# Altium schematic sheet Sensors_revB3.SchDoc
size A3; SheetNumber: 2; SheetTotal: 3
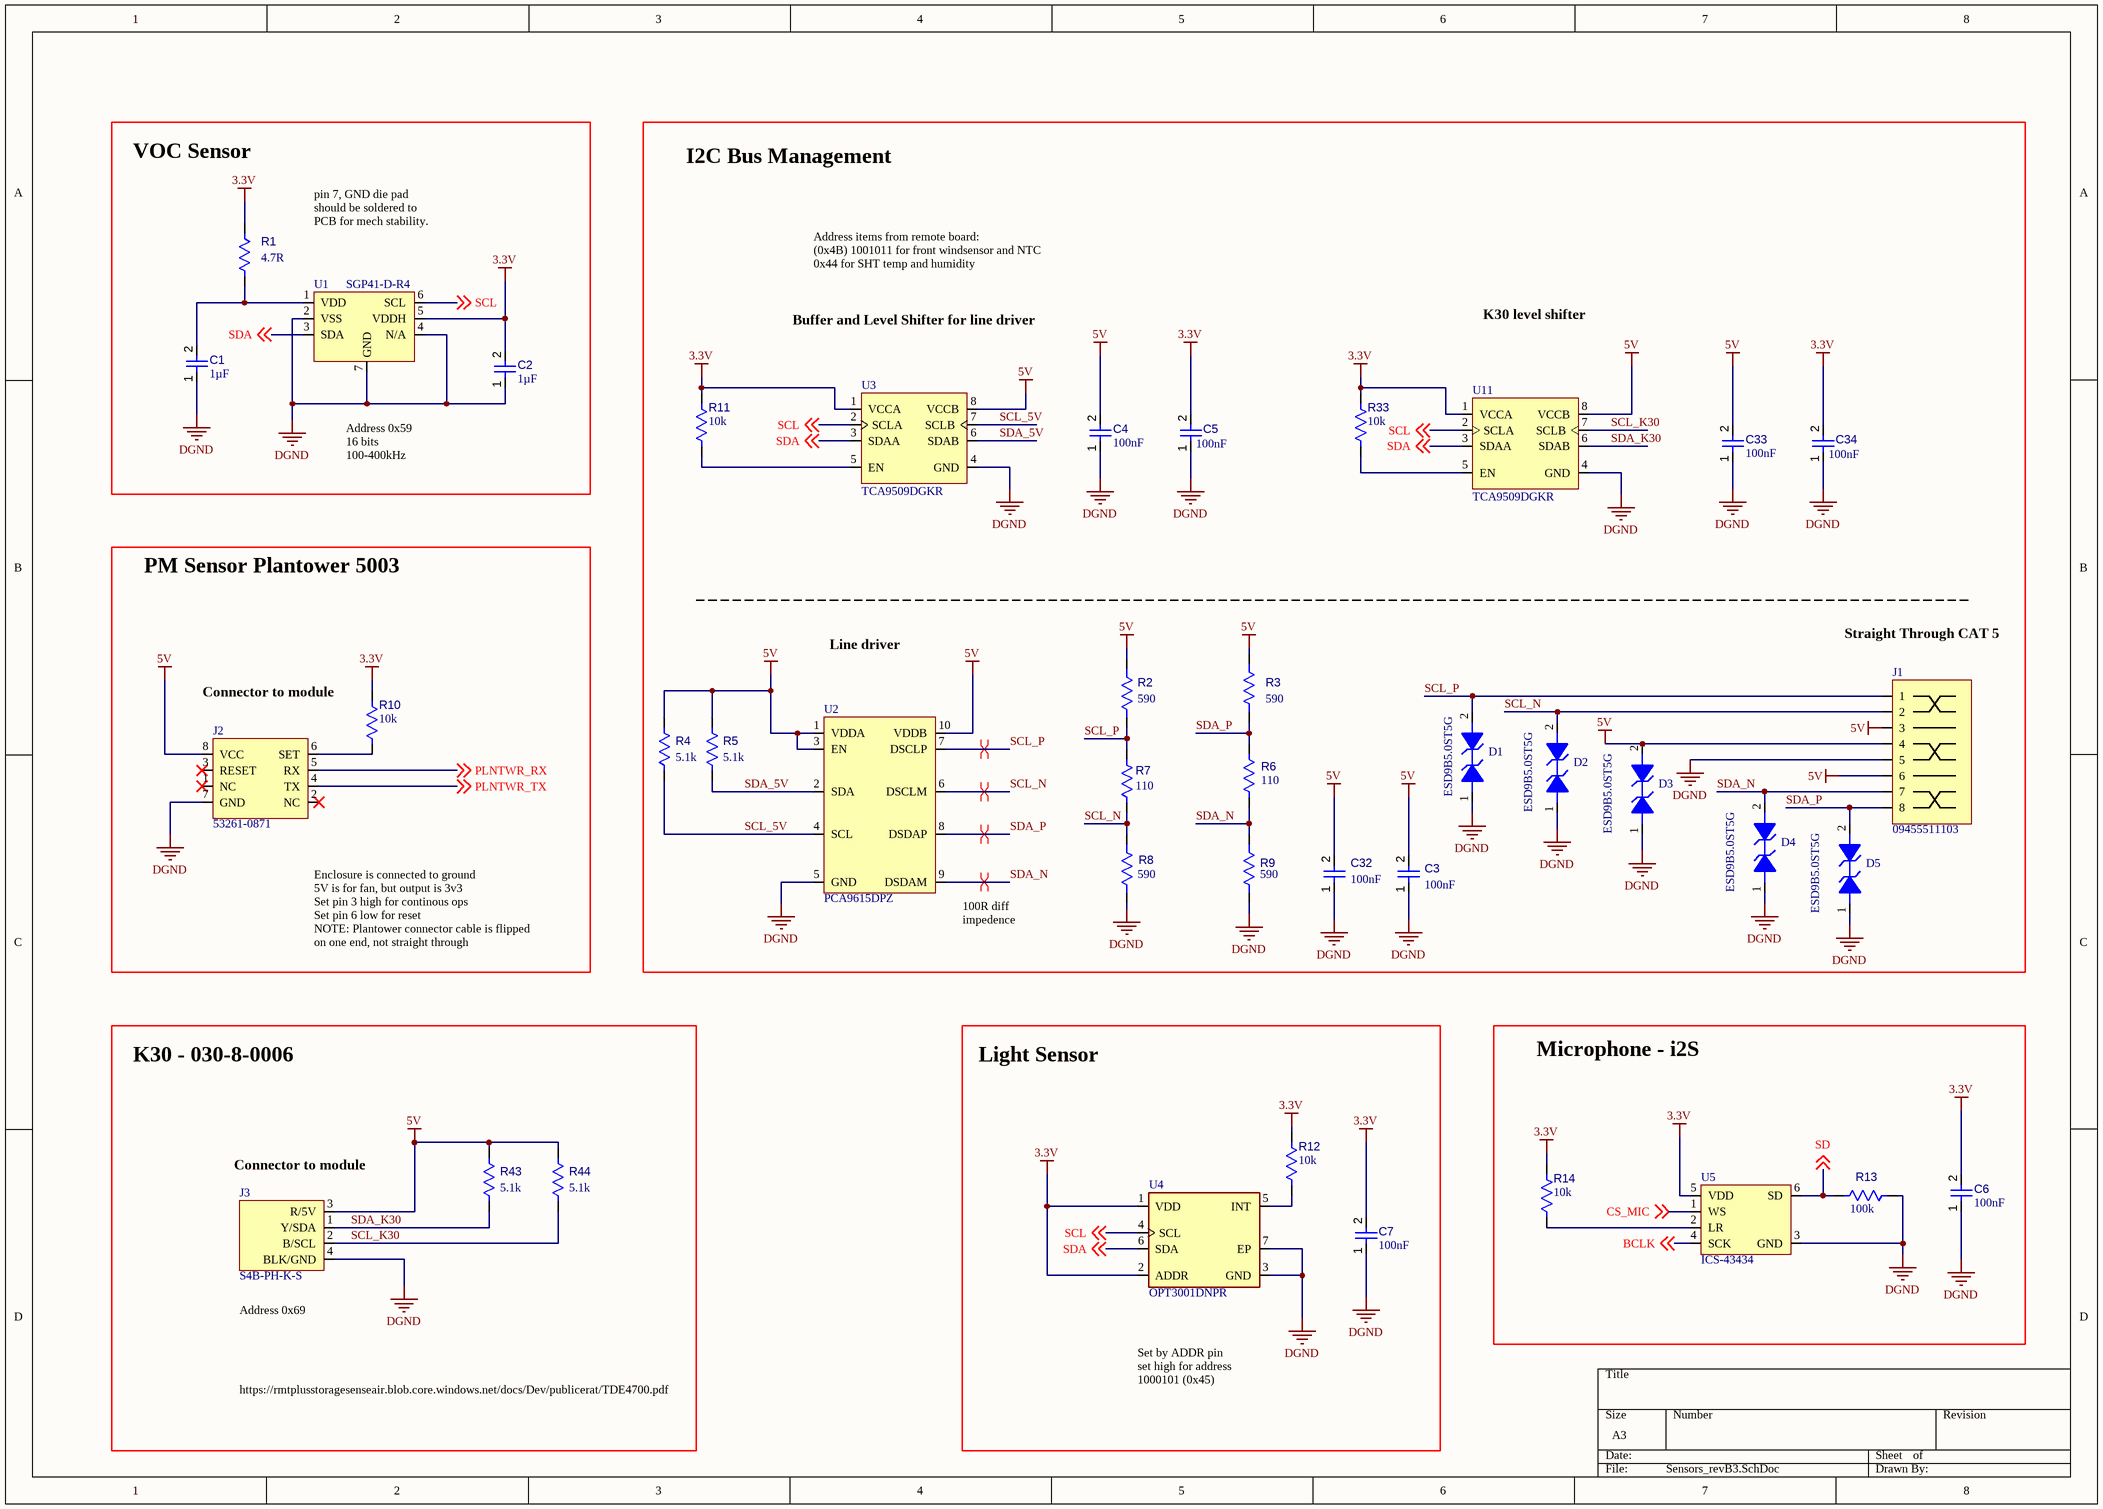
[diagram p0: Sensors_revB3.SchDoc]

## Parts
C1  value 1µF  [MANUF_CAP_0603]  (hidden comment: CL10B105KA8NFNC)
C2  value 1µF  [MANUF_CAP_0603]  (hidden comment: CL10B105KA8NFNC)
C3  value 100nF  [MANUF_CAP_0603]  (hidden comment: CC0603KRX7R7BB104)
C4  value 100nF  [MANUF_CAP_0603]  (hidden comment: CC0603KRX7R7BB104)
C5  value 100nF  [MANUF_CAP_0603]  (hidden comment: CC0603KRX7R7BB104)
C6  value 100nF  [MANUF_CAP_0603]  (hidden comment: CC0603KRX7R7BB104)
C7  value 100nF  [MANUF_CAP_0603]  (hidden comment: CC0603KRX7R7BB104)
C32  value 100nF  [MANUF_CAP_0603]  (hidden comment: CC0603KRX7R7BB104)
C33  value 100nF  [MANUF_CAP_0603]  (hidden comment: CC0603KRX7R7BB104)
C34  value 100nF  [MANUF_CAP_0603]  (hidden comment: CC0603KRX7R7BB104)
D1  ESD9B5.0ST5G  [ONSC-SOD-923-2-514AB-01_V]
D2  ESD9B5.0ST5G  [ONSC-SOD-923-2-514AB-01_V]
D3  ESD9B5.0ST5G  [ONSC-SOD-923-2-514AB-01_V]
D4  ESD9B5.0ST5G  [ONSC-SOD-923-2-514AB-01_V]
D5  ESD9B5.0ST5G  [ONSC-SOD-923-2-514AB-01_V]
J1  09455511103  [09455511103-Footprint-1]
J2  53261-0871  [FP-532610871-MFG]
J3  S4B-PH-K-S  [S4B-PH-K-S-Footprint-1]
R1  value 4.7R  [0805]  (hidden comment: SR0805FR-7W4R7L)
R2  value 590  [MANUF_RES_0603]  (hidden comment: ERJ-3EKF5900V)
R3  value 590  [MANUF_RES_0603]  (hidden comment: ERJ-3EKF5900V)
R4  value 5.1k  [0805]  (hidden comment: RC0805JR-075K1L)
R5  value 5.1k  [0805]  (hidden comment: RC0805JR-075K1L)
R6  value 110  [MANUF_RES_0603]  (hidden comment: RMCF0603FT110R)
R7  value 110  [MANUF_RES_0603]  (hidden comment: RMCF0603FT110R)
R8  value 590  [MANUF_RES_0603]  (hidden comment: ERJ-3EKF5900V)
R9  value 590  [MANUF_RES_0603]  (hidden comment: ERJ-3EKF5900V)
R10  value 10k  [MANUF_RES_0603]  (hidden comment: RC0603FR-0710KL)
R11  value 10k  [MANUF_RES_0603]  (hidden comment: RC0603FR-0710KL)
R12  value 10k  [MANUF_RES_0603]  (hidden comment: RC0603FR-0710KL)
R13  value 100k  [FP-RNCP0805-MFG]  (hidden comment: RCC0805100KFKEA)
R14  value 10k  [MANUF_RES_0603]  (hidden comment: RC0603FR-0710KL)
R33  value 10k  [MANUF_RES_0603]  (hidden comment: RC0603FR-0710KL)
R43  value 5.1k  [0805]  (hidden comment: RC0805JR-075K1L)
R44  value 5.1k  [0805]  (hidden comment: RC0805JR-075K1L)
U1  SGP41-D-R4  [SGP41-D-R4-Footprint-1]
U2  PCA9615DPZ  [TSSOP50P490X110-10N]
U3  TCA9509DGKR  [TSOP65P490X110-8N]
U4  OPT3001DNPR  [FP-DNP0006A-MFG]
U5  ICS-43434  [FP-ICS-43434-MFG]
U11  TCA9509DGKR  [TSOP65P490X110-8N]

## Blocks framed on the sheet
VOC Sensor: C1 C2 R1 U1
I2C Bus Management: C3-C5 C32-C34 D1-D5 J1 R2-R9 R11 R33 U2 U3 U11
PM Sensor Plantower 5003: J2 R10
K30 - 030-8-0006: J3 R43 R44
Light Sensor: C7 R12 U4
Microphone - i2S: C6 R13 R14 U5

## Nets
3.3V: C2.2 C5.2 C6.2 C7.2 C34.2 R1.2 R10.1 R11.1 R12.1 R14.1 R33.1 U1.5(VDDH) U3.1(VCCA) U4.1(VDD) U4.2(ADDR) U5.5(VDD) U11.1(VCCA)
5V: C3.2 C4.2 C32.2 C33.2 D3.2(A2) J1.3 J1.4 J1.6 J2.8(VCC) J3.3(R/5V) R2.2 R3.2 R4.2 R5.2 R43.2 R44.2 U2.1(VDDA) U2.3(EN) U2.10(VDDB) U3.8(VCCB) U11.8(VCCB)
DGND: C1.1 C2.1 C3.1 C4.1 C5.1 C6.1 C7.1 C32.1 C33.1 C34.1 D1.1(A1) D2.1(A1) D3.1(A1) D4.1(A1) D5.1(A1) J1.5 J2.7(GND) J3.4(BLK/GND) R8.1 R9.1 R13.1 U1.2(VSS) U1.4(N/A) U1.7(GND) U2.5(GND) U3.4(GND) U4.3(GND) U4.7(EP) U5.3(GND) U11.4(GND)
BCLK: U5.4(SCK) ; off-sheet BCLK
CS_MIC: U5.1(WS) ; off-sheet CS_MIC
PLNTWR_RX: J2.5(RX) ; off-sheet PLNTWR_RX
PLNTWR_TX: J2.4(TX) ; off-sheet PLNTWR_TX
SCL: U1.6(SCL) U3.2(SCLA) U4.4(SCL) U11.2(SCLA) ; off-sheet SCL
SCL_5V: R4.1 U2.4(SCL) U3.7(SCLB)
SCL_K30: J3.2(B/SCL) R44.1 U11.7(SCLB)
SCL_N: D2.2(A2) J1.2 R7.1 R8.2 U2.6(DSCLM)
SCL_P: D1.2(A2) J1.1 R2.1 R7.2 U2.7(DSCLP)
SD: R13.2 U5.6(SD) ; off-sheet SD
SDA: U1.3(SDA) U3.3(SDAA) U4.6(SDA) U11.3(SDAA) ; off-sheet SDA
SDA_5V: R5.1 U2.2(SDA) U3.6(SDAB)
SDA_K30: J3.1(Y/SDA) R43.1 U11.6(SDAB)
SDA_N: D4.2(A2) J1.7 R6.1 R9.2 U2.9(DSDAM)
SDA_P: D5.2(A2) J1.8 R3.1 R6.2 U2.8(DSDAP)
NetC1_2: C1.2 R1.1 U1.1(VDD)
NetJ2_6: J2.6(SET) R10.2
NetR11_2: R11.2 U3.5(EN)
NetR12_2: R12.2 U4.5(INT)
NetR14_2: R14.2 U5.2(LR)
NetR33_2: R33.2 U11.5(EN)

Not connected (* = marked no-connect by the designer): J2 1(NC)* 2(NC)* 3(RESET)*

## Layout directives
differential pair: SCL_N, SCL_P, SDA_N, SDA_P

## Notes on the sheet
- pin 7, GND die pad should be soldered to PCB for mech stability.
- Address items from remote board:
  (0x4B) 1001011 for front windsensor and NTC
  0x44 for SHT temp and humidity
- Buffer and Level Shifter for line driver
- K30 level shifter
- Address 0x59
  16 bits
  100-400kHz
- Line driver
- (near J1) Straight Through CAT 5
- (near R10) Connector to module
- Enclosure is connected to ground
  5V is for fan, but output is 3v3
  Set pin 3 high for continous ops
  Set pin 6 low for reset
  NOTE: Plantower connector cable is flipped on one end, not straight through
- (near U2) 100R diff impedence
- (near J3) Connector to module
- (near J3) Address 0x69
- Set by ADDR pin
  set high for address 1000101 (0x45)
- https://rmtplusstoragesenseair.blob.core.windows.net/docs/Dev/publicerat/TDE4700.pdf

## Library data of the parts
C1 C2 = CMP-001-00098-2: Ceramic Capacitor, Multilayer, Ceramic, 25V, 10% +Tol, 10% -Tol, X7R, 15% TC, 1uF, Surface Mount, 0603; Pins: 2; Mounting Technology: Surface Mount; Min Operating Temperature: -55°C; Case/Package: 0603; Capacitor Type: Ceramic; RoHS Compliant: Yes; Max Operating Temperature: 125°C
C3-C7 C32-C34 = CMP-001-00099-4: Ceramic Capacitor, Multilayer, Ceramic, 16V, 10% +Tol, 10% -Tol, X7R, 15% TC, 0.1uF, Surface Mount, 0603; Pins: 2; Min Operating Temperature: -55°C; Max Operating Temperature: 125°C; Case/Package: 0603; RoHS Compliant: Yes; Mounting Technology: Surface Mount; Capacitor Type: Ceramic
D1-D5 = CMP-004-00032-1: Trans Voltage Suppressor Diode, 5V V(RWM), Bidirectional, 1 Element, Silicon; Pins: 2; Max Operating Temperature: 150°C; RoHS Compliant: Yes; Min Operating Temperature: -55°C
J1 = CMP-002-00071-6: Telecom and Datacom Connector, 8 Contact(s), Female, Straight, Solder Terminal, Locking, Jack; Mounting Technology: Board; RoHS Compliant: Yes; Max Operating Temperature: 70°C; Min Operating Temperature: -40°C; Connector Type: TELECOM AND DATACOM CONNECTOR
J2 = CMP-010-00028-3: PLANTOWER 5003 CONNECTOR - Board Connector, 8 Contact(s), 1 Row(s), Male, Right Angle, 0.049 inch Pitch, Surface Mount Terminal, Locking, Natural Insulator, Receptacle; RoHS Compliant: Yes; Max Operating Temperature: 85°C; Min Operating Temperature: -40°C; Mounting Technology: Board
J3 = CMP-002-00076-3: K30 cable connector
R1 = CMP-009-00185-2: Fixed Resistor, Metal Glaze/thick Film, 0.25W, 4.7ohm, 150V, 1% +/-Tol, 200ppm/Cel, Surface Mount, 0805; Power: 250mW; Case/Package: 0805; Mounting Technology: Surface Mount; RoHS Compliant: Yes; Pins: 2; Max Operating Temperature: 155°C; Min Operating Temperature: -55°C; Tolerance: 1%
R2 R3 R8 R9 = CMP-009-00193-4: Fixed Resistor, Metal Glaze/thick Film, 0.1W, 590ohm, 75V, 1% +/-Tol, 100ppm/Cel, Surface Mount, 0603; Power: 100mW; Tolerance: 1%; Pins: 2; Mounting Technology: Surface Mount; Max Operating Temperature: 155°C; Min Operating Temperature: -55°C; RoHS Compliant: Yes; Case/Package: 0603
R4 R5 R43 R44 = CMP-009-00191-2: Fixed Resistor, Metal Glaze/thick Film, 0.125W, 5100ohm, 150V, 5% +/-Tol, 100ppm/Cel, Surface Mount, 0805; Power: 125mW; Min Operating Temperature: -55°C; Case/Package: 0805; Pins: 2; Max Operating Temperature: 155°C; Tolerance: 5%; Mounting Technology: Surface Mount; RoHS Compliant: Yes
R6 R7 = CMP-009-00194-4: Fixed Resistor, Metal Glaze/thick Film, 0.1W, 110ohm, 75V, 1% +/-Tol, 100ppm/Cel, Surface Mount, 0603; Power: 100mW; Tolerance: 1%; Min Operating Temperature: -55°C; Case/Package: 0603; RoHS Compliant: Yes; Pins: 2; Mounting Technology: Surface Mount; Max Operating Temperature: 155°C
R10-R12 R14 R33 = CMP-009-00204-2: Fixed Resistor, Metal Glaze/thick Film, 0.1W, 10000ohm, 75V, 1% +/-Tol, 100ppm/Cel, Surface Mount, 0603; Power: 100mW; Pins: 2; Max Operating Temperature: 155°C; Case/Package: 0603; RoHS Compliant: Yes; Tolerance: 1%; Min Operating Temperature: -55°C; Mounting Technology: Surface Mount
R13 = CMP-009-00179-2: Fixed Resistor, Metal Glaze/thick Film, 0.25W, 100000ohm, 200V, 1% +/-Tol, 100ppm/Cel, Surface Mount, 0805; Power: 250mW; Case/Package: 0805; RoHS Compliant: Yes; Max Operating Temperature: 155°C; Tolerance: 1%; Min Operating Temperature: -55°C; Mounting Technology: Surface Mount; Pins: 2
U1 = CMP-010-00025-3: Air Quality Gas Sensor Voc/no
U2 = CMP-00024-00007-3: IC Redriver I2C 2CH 10TSSOP
U3 U11 = CMP-00024-00006-2: Interface Circuit, PDSO8; Pins: 8; Case/Package: TSSOP; Min Operating Temperature: -40°C; RoHS Compliant: Yes; Max Operating Temperature: 85°C
U4 = CMP-010-00029-2: Analog Circuit, 1 Func, 1 Channel, PDSO6; Nominal Supply Voltage: 3.3V; Max Supply Voltage: 3.6V; Min Supply Voltage: 1.6V; Pins: 6; Max Operating Temperature: 85°C; Case/Package: HVSON; Min Operating Temperature: -40°C; RoHS Compliant: Yes
U5 = CMP-010-00026-5: MICROPHONE MEMS DIGITAL I2S OMNI